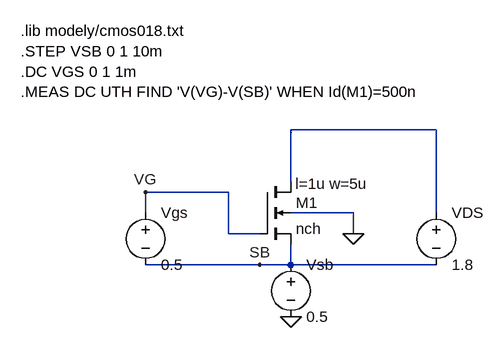
[diagram p0: schematic N3-mos.asc]
N3-mos.asc, the LTspice schematic file:
Version 4
SHEET 1 880 680
WIRE 448 64 224 64
WIRE 224 144 224 64
WIRE 128 160 0 160
WIRE 0 192 0 160
WIRE 320 192 224 192
WIRE 448 192 448 64
WIRE 128 224 128 160
WIRE 176 224 128 224
WIRE 320 224 320 192
WIRE 176 272 0 272
WIRE 224 272 224 240
WIRE 224 272 176 272
WIRE 448 272 224 272
FLAG 224 352 0
FLAG 0 160 VG
FLAG 320 224 0
FLAG 176 272 SB
SYMBOL nmos4 176 144 R0
WINDOW 123 55 3 Left 2
SYMATTR Value2 l=1u w=5u
SYMATTR InstName M1
SYMATTR Value nch
SYMBOL voltage 0 176 R0
WINDOW 123 0 0 Left 0
WINDOW 39 0 0 Left 0
SYMATTR InstName Vgs
SYMATTR Value 0.5
SYMBOL voltage 448 176 R0
WINDOW 123 0 0 Left 0
WINDOW 39 0 0 Left 0
SYMATTR InstName VDS
SYMATTR Value 1.8
SYMBOL voltage 224 256 R0
WINDOW 123 0 0 Left 0
WINDOW 39 0 0 Left 0
SYMATTR InstName Vsb
SYMATTR Value 0.5
TEXT -192 -88 Left 2 !.lib modely/cmos018.txt\n.STEP VSB 0 1 10m\n.DC VGS 0 1 1m\n.MEAS DC UTH FIND 'V(VG)-V(SB)' WHEN Id(M1)=500n

The netlist it stands for:
* N3-mos.asc
M1 N001 VG SB 0 nch l=1u w=5u
Vgs VG SB 0.5
VDS N001 SB 1.8
Vsb SB 0 0.5
.model NMOS NMOS
.model PMOS PMOS
.lib standard.mos
.lib modely/cmos018.txt
.STEP VSB 0 1 10m
.DC VGS 0 1 1m
.MEAS DC UTH FIND 'V(VG)-V(SB)' WHEN Id(M1)=500n
.backanno
.end

* Results of the author's LTspice run, read from the files saved beside the schematic
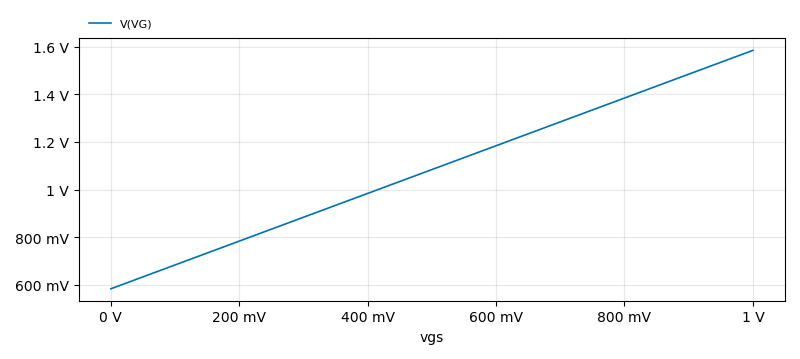
[diagram p1: DC transfer characteristic of N3-mos.asc, plotted from the saved traces]
* DC transfer characteristic, 1 run:
*   V(VG): 584 mV at vgs=0 V, 1.584 V at vgs=1 V, min 584 mV, max 1.584 V
* From the log:
*   uth: (v(vg)-v(sb))=0.541525 at 0.541525